# EAGLE design controller (EAGLE 5.08)
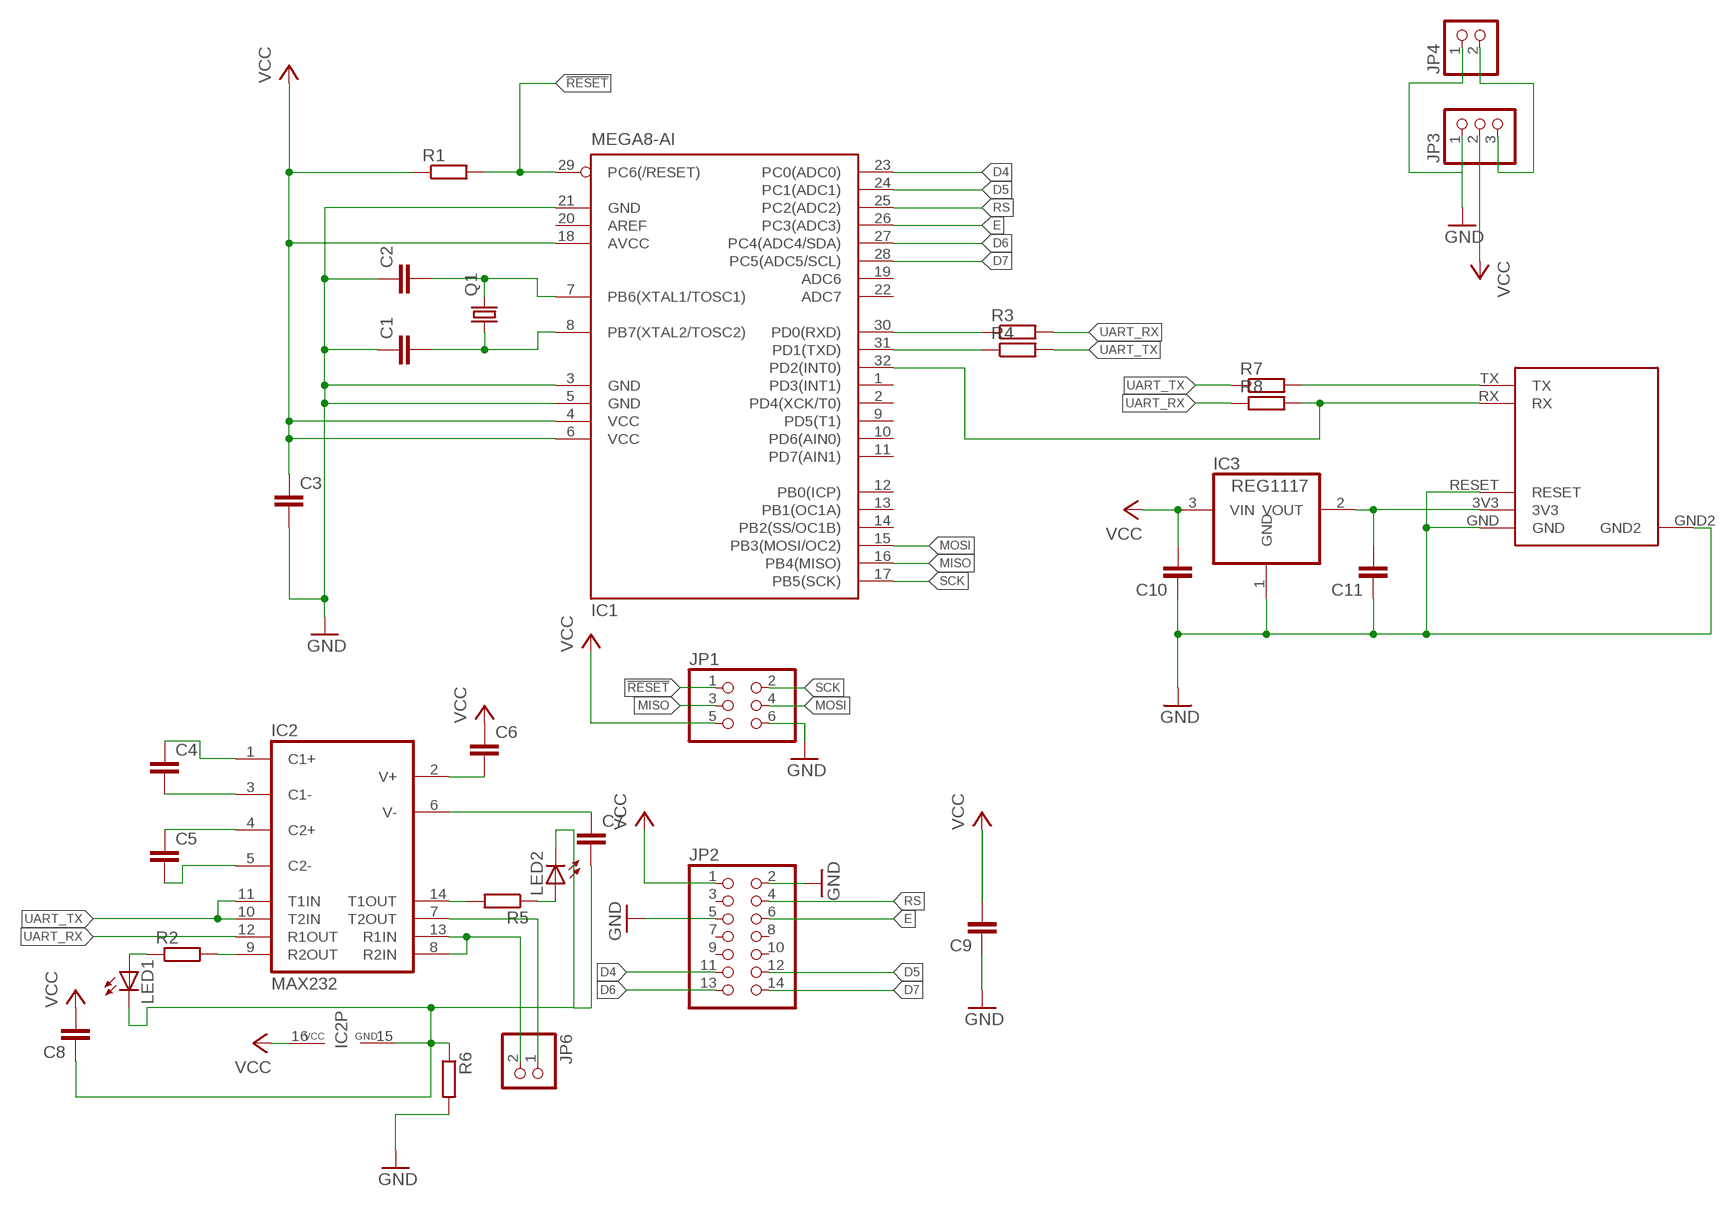
[diagram p0: schematic, sheet 1]

## Parts
C1  C-EUC0805  [C0805]
C2  C-EUC0805  [C0805]
C3  C-EUC0805  [C0805]
C4  C-EUC0805  [C0805]
C5  C-EUC0805  [C0805]
C6  C-EUC0805  [C0805]
C7  C-EUC0805  [C0805]
C8  C-EUC0805  [C0805]
C9  C-EUC0805  [C0805]
C10  C-EUC0805  [C0805]
C11  C-EUC0805  [C0805]
IC1  MEGA8-AI  [TQFP32-08]
IC2  MAX232  [DIL16]
IC3  REG1117  [SOT223]
JP1  PINHD-2X03_2.54-SMD  [2X03SMD]
JP2  PINHD-2X07_2.54-SMD  [2X07SMD]
JP3  PINHD-1X3/90  [1X03/90]
JP4  PINHD-1X2  [1X02]
JP6  PINHD-1X2  [1X02]
LED1  LEDB152  [Q62902-B152]
LED2  LEDB152  [Q62902-B152]
Q1  CRYSTALSM49  [SM49]
R1  R-EU_M1206  [M1206]
R2  R-EU_M1206  [M1206]
R3  R-EU_M0805  [M0805]
R4  R-EU_M0805  [M0805]
R5  R-EU_M1206  [M1206]
R6  R-EU_M1206  [M1206]
R7  R-EU_M1206  [M1206]
R8  R-EU_M1206  [M1206]
U$1  BLUETOOTH  [BLUETOOTH]

## Nets
!RESET: IC1.29(PC6(/RESET)) JP1.1 R1.2
D4: IC1.23(PC0(ADC0)) JP2.11
D5: IC1.24(PC1(ADC1)) JP2.12
D6: IC1.27(PC4(ADC4/SDA)) JP2.13
D7: IC1.28(PC5(ADC5/SCL)) JP2.14
E: IC1.26(PC3(ADC3)) JP2.6
GND: C1.1 C2.1 C3.2 C9.1 C10.1 C11.1 IC1.3(GND) IC1.5(GND) IC1.21(GND) IC3.1(GND) JP1.6 JP2.2 JP2.5 JP3.1 JP4.1 R6.2 U$1.GND U$1.GND2 U$1.RESET
MISO: IC1.16(PB4(MISO)) JP1.3
MOSI: IC1.15(PB3(MOSI/OC2)) JP1.4
N$1: C5.1 IC2.4(C2+)
N$2: C5.2 IC2.5(C2-)
N$3: C2.2 IC1.7(PB6(XTAL1/TOSC1)) Q1.2
N$4: C1.2 IC1.8(PB7(XTAL2/TOSC2)) Q1.1
N$5: C4.2 IC2.3(C1-)
N$6: C4.1 IC2.1(C1+)
N$7: C6.2 IC2.2(V+)
N$8: C7.1 IC2.6(V-)
N$9: IC2.9(R2OUT) R2.2
N$10: IC2.8(R2IN) IC2.13(R1IN) JP6.2
N$11: LED1.A R2.1
N$12: IC2.7(T2OUT) JP6.1
N$13: IC1.30(PD0(RXD)) R3.1
N$14: IC1.31(PD1(TXD)) R4.1
N$15: IC1.32(PD2(INT0)) R8.2 U$1.RX
N$16: C11.2 IC3.2(VOUT) U$1.3V3
N$17: IC2.14(T1OUT) R5.2
N$18: LED2.A R5.1
N$20: C7.2 C8.1 IC2.15(GND) LED1.K(C) LED2.K(C) R6.1
N$24: R7.2 U$1.TX
PIRANI_12: JP3.3 JP4.2
RS: IC1.25(PC2(ADC2)) JP2.4
SCK: IC1.17(PB5(SCK)) JP1.2
UART_RX: IC2.12(R1OUT) R3.2 R8.1
UART_TX: IC2.10(T2IN) IC2.11(T1IN) R4.2 R7.1
VCC: C3.1 C6.1 C8.2 C9.2 C10.2 IC1.4(VCC) IC1.6(VCC) IC1.18(AVCC) IC2.16(VCC) IC3.3(VIN) JP1.5 JP2.1 JP3.2 R1.1
Unconnected: IC1.1(PD3(INT1)) IC1.2(PD4(XCK/T0)) IC1.9(PD5(T1)) IC1.10(PD6(AIN0)) IC1.11(PD7(AIN1)) IC1.12(PB0(ICP)) IC1.13(PB1(OC1A)) IC1.14(PB2(SS/OC1B)) IC1.19(ADC6) IC1.20(AREF) IC1.22(ADC7) JP2.3 JP2.7 JP2.8 JP2.9 JP2.10

## Library data of the parts
C1-C11 = rcl:C-EU: CAPACITOR, European symbol
IC1 = atmel:MEGA8: MICROCONTROLLER 8 Kbytes FLASH, 1 kbytes SRAM, 512 bytes EEPROM, USART, 6-channel 10 bit ADC, 2-channel 8 bit ADC Pin compatible with Atmega48, ATMega88, ATMega168 Source: avr.lbr
IC2 = maxim:MAX232: RS232 TRANSEIVER
IC3 = burr-brown:REG1117: 800mA and 1A Low Dropout (LDO) Positive Regulator 1.8V, 2.5V, 2.85V, 3.3V, 5V, and Adj
JP1 = pinhead-2:PINHD-2X03: PIN HEADER
JP2 = pinhead-2:PINHD-2X07: PIN HEADER
JP3 = pinhead:PINHD-1X3: PIN HEADER
JP4 JP6 = pinhead:PINHD-1X2: PIN HEADER
LED1 LED2 = led:LED: LED OSRAM: - CHIPLED LG R971, LG N971, LY N971, LG Q971, LY Q971, LO R971, LY R971 LH N974, LH R974 LS Q976, LO Q976, LY Q976 LO Q996 - Hyper CHIPLED LW Q18S LB Q993, LB Q99A, LB R99A - SideLED LS A670, LO A670, LY A670, LG A670, LP A670 LB A673, LV A673, LT A673, LW A673 LH A674 LY A675 LS A676, LA A676, LO A676, LY A676, LW A676 LS A679, LY A679, LG A679 - Hyper Micro SIDELED® LS Y876, LA Y876, LO Y876, LY Y876 LT Y87S - SmartLED LW L88C, LW L88S LB L89C, LB L89S, LG L890 LS L89K, LO L89K, LY L89K LS L896, LA L896, LO L896, LY L896 - TOPLED LS T670, LO T670, LY T670, LG T670, LP T670 LSG T670, LSP T670, LSY T670, LOP T670, LYG T670 LG T671, LOG T671, LSG T671 LB T673, LV T673, LT T673, LW T673 LH T674 LS T676, LA T676, LO T676, LY T676, LB T676, LH T676, LSB T676, LW T676 LB T67C, LV T67C, LT T67C, LS T67K, LO T67K, LY T67K, LW E67C LS E67B, LA E67B, LO E67B, LY E67B, LB E67C, LV E67C, LT E67C LW T67C LS T679, LY T679, LG T679 LS T770, LO T770, LY T770, LG T770, LP T770 LB T773, LV T773, LT T773, LW T773 LH T774 LS E675, LA E675, LY E675, LS T675 LS T776, LA T776, LO T776, LY T776, LB T776 LHGB T686 LT T68C, LB T68C - Hyper Mini TOPLED® LB M676 - Mini TOPLED Santana® LG M470 LS M47K, LO M47K, LY M47K Source: http://www.osram.convergy.de LUXEON: - LUMILED® LXK2-PW12-R00, LXK2-PW12-S00, LXK2-PW14-U00, LXK2-PW14-V00 LXK2-PM12-R00, LXK2-PM12-S00, LXK2-PM14-U00 LXK2-PE12-Q00, LXK2-PE12-R00, LXK2-PE12-S00, LXK2-PE14-T00, LXK2-PE14-U00 LXK2-PB12-K00, LXK2-PB12-L00, LXK2-PB12-M00, LXK2-PB14-N00, LXK2-PB14-P00, LXK2-PB14-Q00 LXK2-PR12-L00, LXK2-PR12-M00, LXK2-PR14-Q00, LXK2-PR14-R00 LXK2-PD12-Q00, LXK2-PD12-R00, LXK2-PD12-S00 LXK2-PH12-R00, LXK2-PH12-S00 LXK2-PL12-P00, LXK2-PL12-Q00, LXK2-PL12-R00 Source: www.luxeon.com KINGBRIGHT: KA-3528ASYC Source: www.kingbright.com
Q1 = crystal:CRYSTAL: CRYSTAL
R1-R8 = resistor:R-EU_: RESISTOR, European symbol
U$1 = connectors:BLUETOOTH

## Board
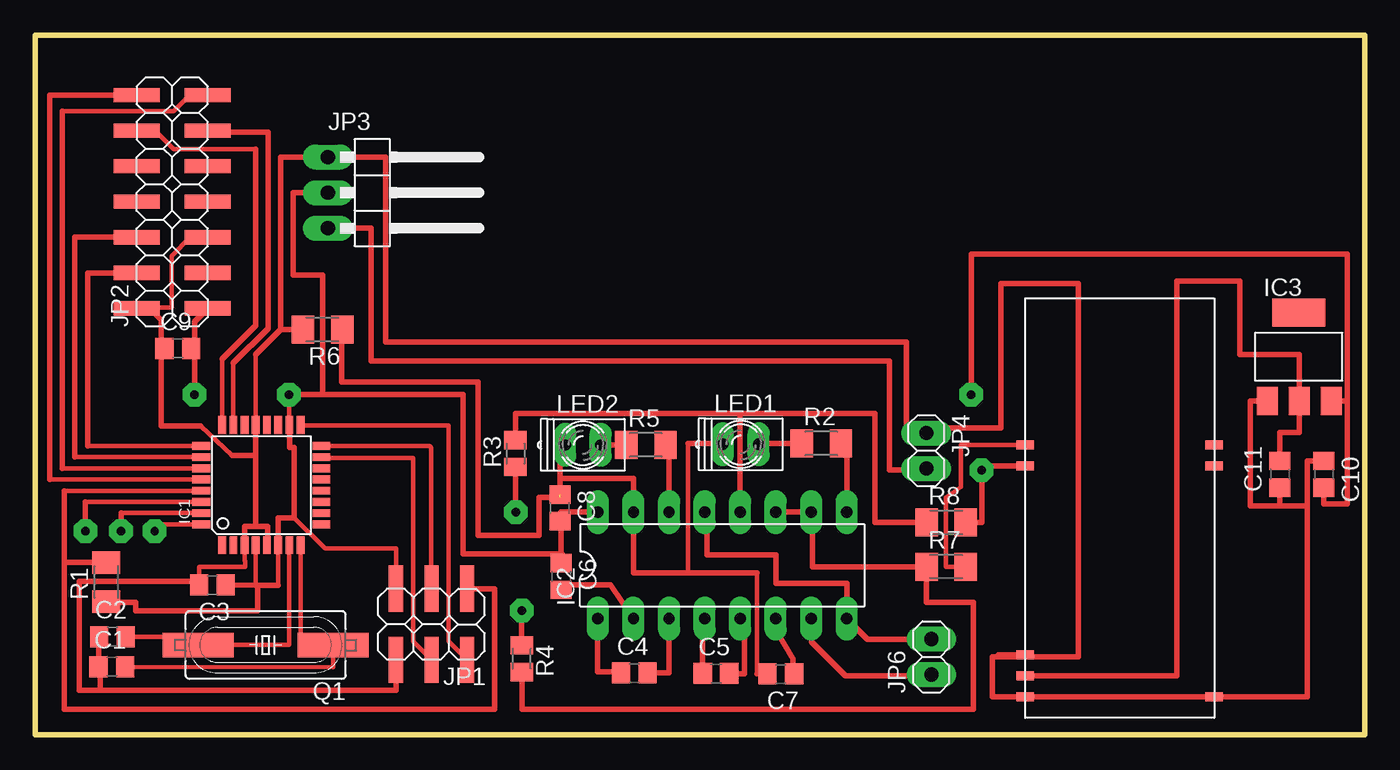
[diagram p1: board, top side]
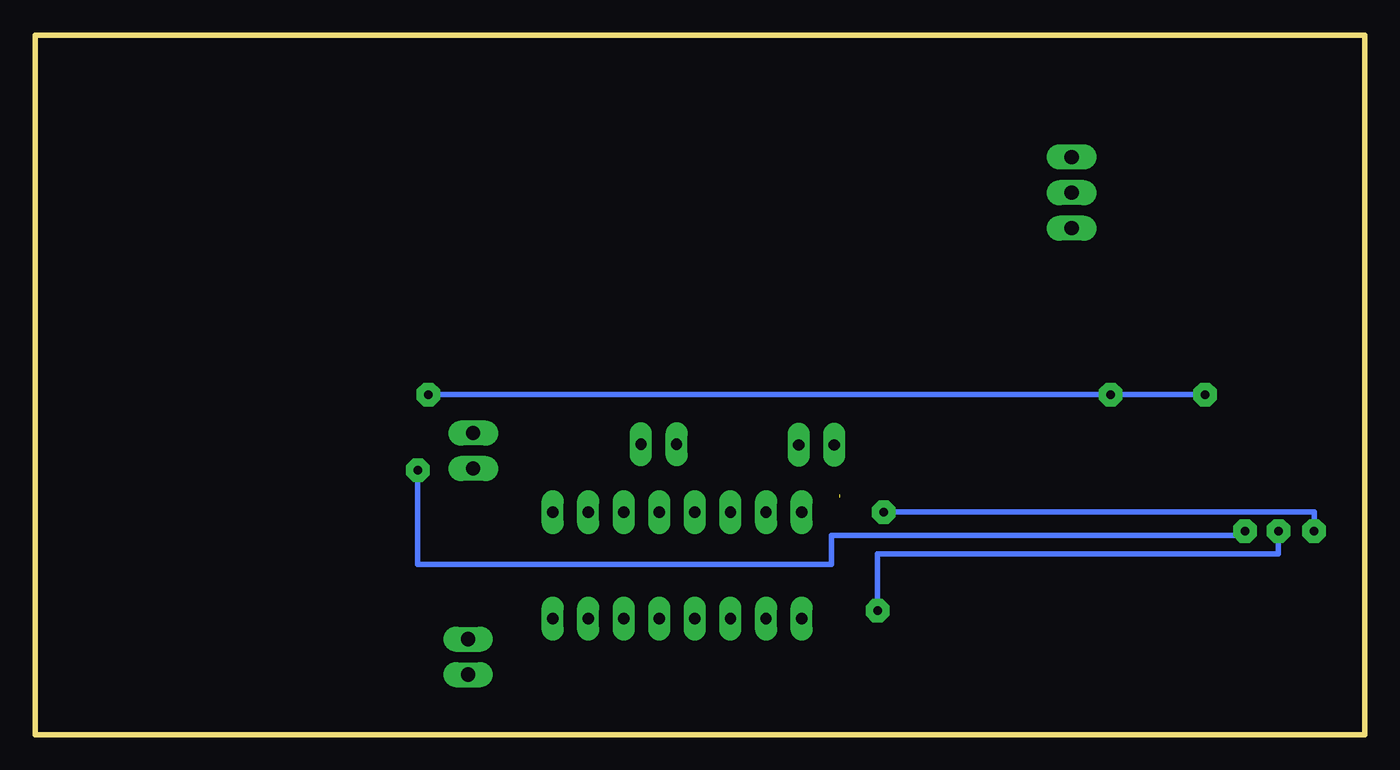
[diagram p2: board, bottom side, seen from below]

Size 95 x 50 mm. Coordinates in mm from the lower left corner, seen from the top.
Outline: 0,0 0,50 95,50 95,0 0,0
Copper layers (1*16): Top 0.035mm / dielectric 1.5mm / Bottom 0.035mm
Design rules "default *": minimum track width 0.2mm, minimum drill 0.2mm, track to track 0.2mm, track to pad 0.2mm, pad to pad 0.2mm, via to via 0.25mm, smd to smd 0.2mm, copper to edge 0.2mm, drill to drill 0.2mm, minimum pad ring 15mil, minimum via ring 12mil, stop-mask expansion 4mil, vias tented up to drill 0mil, thermal gap 10mil

### Footprints (pad centres in the part's own frame; a part is rotated, then mirrored left to right if it is on the bottom)
C0805 = smd 1.3 x 1.5: 1 -0.95,0; 2 0.95,0
TQFP32-08 = smd 1.27 x 0.559: 1 -4.293,2.8; 2 -4.293,2; 3 -4.293,1.2; 4 -4.293,0.4; 5 -4.293,-0.4; 6 -4.293,-1.2; 7 -4.293,-2; 8 -4.293,-2.8; 17 4.293,-2.8; 18 4.293,-2; 19 4.293,-1.2; 20 4.293,-0.4; 21 4.293,0.4; 22 4.293,1.2; 23 4.293,2; 24 4.293,2.8 | smd 0.559 x 1.27: 9 -2.8,-4.293; 10 -2,-4.293; 11 -1.2,-4.293; 12 -0.4,-4.293; 13 0.4,-4.293; 14 1.2,-4.293; 15 2,-4.293; 16 2.8,-4.293; 25 2.8,4.293; 26 2,4.293; 27 1.2,4.293; 28 0.4,4.293; 29 -0.4,4.293; 30 -1.2,4.293; 31 -2,4.293; 32 -2.8,4.293
DIL16 = drill 0.813 long: 1 -8.89,-3.81; 2 -6.35,-3.81; 3 -3.81,-3.81; 4 -1.27,-3.81; 5 1.27,-3.81; 6 3.81,-3.81; 7 6.35,-3.81; 8 8.89,-3.81; 9 8.89,3.81; 10 6.35,3.81; 11 3.81,3.81; 12 1.27,3.81; 13 -1.27,3.81; 14 -3.81,3.81; 15 -6.35,3.81; 16 -8.89,3.81
SOT223 = smd 1.499 x 2.007: 1 -2.261,-3.15; 2 0.025,-3.15; 3 2.311,-3.15 | smd 3.81 x 2.007: 4 0,3.15
2X03SMD = smd 1.016 x 3.302: 1 -1.27,-3.81; 2 -1.27,1.27; 3 1.27,-3.81; 4 1.27,1.27; 5 3.81,-3.81; 6 3.81,1.27
2X07SMD = smd 1.016 x 3.302: 1 -1.27,-3.81; 2 -1.27,1.27; 3 1.27,-3.81; 4 1.27,1.27; 5 3.81,-3.81; 6 3.81,1.27; 7 6.35,-3.81; 8 6.35,1.27; 9 8.89,-3.81; 10 8.89,1.27; 11 11.43,-3.81; 12 11.43,1.27; 13 13.97,-3.81; 14 13.97,1.27
1X03/90 = drill 1.016 long: 1 -2.54,-3.81; 2 0,-3.81; 3 2.54,-3.81
1X02 = drill 1.016 long: 1 -1.27,0; 2 1.27,0
Q62902-B152 = drill 0.813 long: A 1.27,0; K -1.27,0
SM49 = smd 5.08 x 1.778: 1 -4.826,0; 2 4.826,0
M1206 = smd 1.6 x 2: 1 -1.4,0; 2 1.4,0
M0805 = smd 1.3 x 1.6: 1 -0.95,0; 2 0.95,0
BLUETOOTH = smd 1.27 x 0.635: 3V3 0,1.5; GND 0,0; GND2 13.5,0; RESET 0,3; RX 0,16.5; RX_LED 13.5,16.5; TX 0,18; TX_LED 13.5,18

### Placement (x,y rotation side)
C1  5.49,4.85 0 top
C2  5.54,7 0 top
C3  12.68,10.68 180 top
C4  42.83,4.39 0 top
C5  48.66,4.37 0 top
C6  37.6,11.29 270 top
C7  53.3,4.33 180 top
C8  37.5,16.2 270 top
C9  10.2,27.6 0 top
C10  92.1,18.6 270 top
C11  88.95,18.6 90 top
IC1  16.18,17.82 90 top
IC2  49.12,12.09 0 top
IC3  90.3,27 0 top
JP1  29.6,6.62 180 top
JP2  8.53,31.73 90 top
JP3  24.73,38.73 270 top
JP4  63.69,20.28 270 top
JP6  64.05,5.55 90 top
LED1  50.43,20.75 0 top
LED2  39.15,20.7 0 top
Q1  16.48,6.39 180 top
R1  5.08,10.9 90 top
R2  56.19,20.82 0 top
R3  34.34,20.09 90 top
R4  34.78,5.42 270 top
R5  43.65,20.7 0 top
R6  20.55,28.95 180 top
R7  65.1,12 0 top
R8  65.1,15.15 0 top
U$1  70.75,2.69 0 top

### Tracks (layer width: path | path; a pad name or v marks a point on that pad's centre or on a via)
!RESET
  Top 0.305: 2.1,17.43 IC1.29
  Top 0.406: 4.82,12.3 R1.2 2.1,12.3 | JP1.1 32.85,10.43 32.85,1.8 2.1,1.8 2.1,12.3 | 2.1,12.3 2.1,17.43
D4
  Top 0.305: IC1.23 14.18,26.55
  Top 0.406: IC1.23 14.1,22.12 | JP2.11 12.34,43.05 16.65,43.05 16.65,29.02 14.18,26.55
D5
  Top 0.305: 8.59,43.16 9.9,41.85 15.75,41.85 | IC1.24 13.38,26.85
  Top 0.406: IC1.24 13.35,22.12 | 8.59,43.16 JP2.12 | 15.75,41.85 15.75,29.23 13.38,26.85
D6
  Top 0.305: 1.95,44.55 9.9,44.55 11.05,45.7 | 1.95,19.02 IC1.27
  Top 0.406: 1.95,19.02 1.95,44.55 | IC1.27 11.88,19.05 | 11.05,45.7 JP2.13
D7
  Top 0.305: 1.05,18.23 IC1.28
  Top 0.406: JP2.14 1.05,45.7 1.05,18.23
E
  Top 0.305: 2.85,19.82 IC1.26
  Top 0.406: JP2.6 2.85,35.54 2.85,19.82 | IC1.26 11.88,19.8
GND
  Top 0.305: 8.1,30.52 9.75,30.52 9.75,34.2 11.09,35.54 | IC1.3 14.97,12.43 15,12.43 15,12 11.72,12 C3.2 | 14.1,19.95 11.85,22.05 | IC1.21 15.78,24.3 15.75,24.32 15.75,27.15
  Top 0.406: 7.26,30.52 JP2.2 7.33,30.52 8.1,30.52 9,29.62 9,28.05 | IC1.3 14.97,14.87 15.78,14.87 | 15.78,14.87 16.64,14.87 16.64,13.53 IC1.5 | 15.78,14.87 15.78,19.95 | JP1.6 25.79,3.15 4.65,3.15 | 4.65,3.15 3.15,3.15 3.15,10.95 11.57,10.95 C3.2 | C2.1 4.54,7 C1.1 4.65,4.85 4.65,3.15 | 11.09,35.54 JP2.5 | 11.85,22.05 9,22.05 9,28.05 | 15.78,19.95 14.1,19.95 | 15.78,19.95 IC1.21 | JP3.1 17.55,41.27 17.55,28.95 | JP3.1 20.32,41.25 | 17.55,28.95 R6.2 | JP3.1 25.05,41.27 25.05,28.05 62.25,28.05 62.25,21.55 JP4.1 63.69,21.9 69,21.9 69,32.25 74.55,32.25 74.55,5.55 68.85,5.55 | 9,28.05 C9.1 | 15.75,27.15 17.55,28.95 | IC3.1 86.85,23.85 86.85,16.35 88.95,16.35 | C10.1 90.9,19.55 90.9,16.35 | 90.9,16.35 90.9,2.69 U$1.GND2 U$1.GND 68.4,2.69 68.4,5.55 68.85,5.55 | 90.9,16.35 88.95,16.35 | 88.95,16.35 C11.1 | U$1.RESET 68.85,5.7 68.85,5.55
MISO
  Top 0.305: IC1.16 28.2,20.62 28.29,20.54 28.29,10.46
  Top 0.406: JP1.3 28.29,10.46
MOSI
  Top 0.305: IC1.15 20.55,19.91 | 20.41,19.75 27.03,19.75 27.03,6.64 JP1.4
  Top 0.406: IC1.15 20.47,19.85 20.41,19.75
N$1
  Top 0.406: IC2.4 47.71,8.28 C5.1
N$2
  Top 0.406: IC2.5 50.7,8.28 50.7,4.35 49.61,4.35 C5.2
N$3
  Top 0.305: IC1.7 18.18,6.39 Q1.2 | C2.2 11.66,7
  Top 0.406: 11.66,7 Q1.2
N$4
  Top 0.305: 18.98,6.39 IC1.8 | Q1.1 21.31,4.81 C1.2
  Top 0.406: Q1.1 18.98,6.39
N$5
  Top 0.406: C4.2 45.3,4.39 IC2.3
N$6
  Top 0.406: IC2.1 40.2,8.28 40.2,4.5 41.88,4.5 C4.1
N$7
  Top 0.406: IC2.2 41.12,10.71 37.6,10.71 C6.2
N$8
  Top 0.406: IC2.6 52.92,7.53 54.15,5.4 54.15,4.28 C7.1
N$9
  Top 0.406: IC2.9 58.01,19.77 R2.2
N$10
  Top 0.406: IC2.13 48,15.9 48,12.84 52.95,12.84 52.95,10.8 58.01,10.8 IC2.8 59.47,6.82 JP6.2
N$11
  Top 0.406: R2.1 51.79,20.8 LED1.A
N$12
  Top 0.406: IC2.7 55.47,6.63 57.9,4.2 63.52,4.2 JP6.1
N$13  (via drill 0.6 pad 1.68)
  Top 0.305: 3.6,16.62 IC1.30
  Top 0.406: v3.6,14.55 3.6,16.62 | R3.1 34.35,18.98 v34.35,15.9
  Bottom 0.406: v3.6,14.55 3.6,15.9 v34.35,15.9
N$14  (via drill 0.6 pad 1.68)
  Top 0.305: 6.15,15.82 IC1.31
  Top 0.406: v6.15,14.55 6.15,15.82 | v34.8,8.85 34.78,8.7 R4.1
  Bottom 0.406: v6.15,14.55 6.15,12.9 34.8,12.9 v34.8,8.85
N$15  (via drill 0.6 pad 1.68)
  Top 0.305: 8.55,15.03 IC1.32
  Top 0.406: 66.6,15.15 R8.2 67.65,15.15 v67.65,18.9 67.65,19.2 U$1.RX | v8.55,14.55 8.55,15.03
  Bottom 0.406: v8.55,14.55 8.55,14.25 38.1,14.25 38.1,12.15 67.65,12.15 v67.65,18.9
N$16
  Top 0.406: U$1.3V3 81.6,4.2 81.6,32.4 86.1,32.4 86.1,27.15 90.33,27.15 IC3.2 90.33,21.6 88.95,21.6 C11.2
N$17
  Top 0.406: IC2.14 45.3,20.45 R5.2
N$18
  Top 0.406: LED2.A R5.1
N$20  (1 unrouted)
  Top 0.305: 46.65,11.55 46.65,20.8 | 51.6,11.55 51.6,4.35
  Top 0.406: LED1.K 49.11,20.8 46.65,20.8 | 37.5,18.3 37.5,20.7 LED2.K | 37.5,18.3 42.77,18.3 IC2.15 42.77,11.55 46.65,11.55 51.6,11.55 | 37.5,18.3 37.5,16.95 36,16.95 36,14.25 31.65,14.25 31.65,25.2 21.9,25.2 21.9,28.95 R6.1 | 51.6,4.35 52.34,4.35 C7.2
N$24
  Top 0.305: U$1.TX 67.5,20.7 66.15,20.7 66.15,17.7 65.1,16.95 65.1,12 R7.2
PIRANI_12
  Top 0.406: JP4.2 62.49,18.9 61.05,18.9 61.05,26.7 24,26.7 24,36.19 JP3.3
RS
  Top 0.305: 3.75,20.62 IC1.25
  Top 0.406: JP2.4 3.75,33 3.75,20.62
SCK
  Top 0.305: JP1.2 29.55,6.67 29.55,22.08 18.98,22.08
  Top 0.406: 18.98,22.08 IC1.17
UART_RX
  Top 0.406: IC2.12 50.37,15.9 50.37,22.82 50.38,22.95 | R3.2 34.34,22.95 50.38,22.95 | R8.1 60,15.15 60,22.95 50.38,22.95
UART_TX
  Top 0.406: IC2.11 IC2.10 55.56,15.9 55.56,11.98 63.6,11.98 | 63.6,11.98 64.19,11.98 | R4.2 34.8,4.33 34.8,1.8 67.05,1.8 67.05,9.45 63.7,9.45 R7.1 63.6,12 63.6,11.98
VCC  (via drill 0.6 pad 1.68)
  Top 0.305: 17.38,10.68 IC1.6 | 15.78,10.68 IC1.4 | JP1.5 25.79,13.29 20.73,13.29 18.52,15.49 | 18.15,22.12 v18.15,24.3
  Top 0.406: 15.9,10.68 15.78,10.68 C3.1 | 15.9,10.68 17.38,10.68 | IC1.6 17.38,15.49 18.52,15.49 18.52,20.54 18.21,20.54 18.21,22.12 IC1.18 18.15,22.12 | IC2.16 37.6,15.9 37.6,15.25 | JP3.2 20.32,38.67 | JP3.2 20.32,38.64 | 12.15,30.46 JP2.1 11.4,29.52 11.4,28.05 | v18.15,24.3 20.55,24.3 | 20.55,24.3 30.6,24.3 30.6,12.9 37.65,12.9 37.65,12 37.6,12 C6.1 37.6,15.25 | JP3.2 18.45,38.73 18.45,32.85 20.55,32.85 20.55,24.3 | v11.4,24.3 11.4,28.05 | 11.4,28.05 C9.2 | 37.6,15.25 C8.2 | v66.9,24.3 66.9,34.35 93.75,34.35 93.75,23.85 | 93.75,23.85 IC3.3 | IC3.3 | IC3.3 93.75,23.85 | 93.75,23.85 93.75,16.5 92.1,16.5 C10.2 | 15.9,10.68 15.9,8.85 7.2,8.85 7.2,9.45 5.08,9.45 R1.1
  Bottom 0.406: v11.4,24.3 v18.15,24.3 v66.9,24.3